# Altium schematic sheet S-Band Antenna.SchDoc: S-Band Antenna
size Letter; Author: Nicholas J. Sorensen; Engineer: Nicholas J. Sorensen; DocumentNumber: 3; SheetNumber: 3; SheetTotal: 4
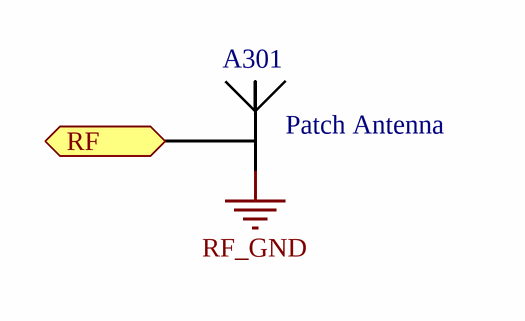
[diagram p0: S-Band Antenna.SchDoc]

## Parts
A301  Patch Antenna  [Patch_Antenna]

## Ports
RF (bidir)

## Nets
RF_GND: A301.2
RF: A301.1 ; port RF

## Notes on the sheet
- (the "License"); you may not use or redistribute this file except in compliance with the License. You
- This file and the information within it are licensed under the terms of the Apache License, Version 2.0
- Copyright
- Unless required by applicable law or agreed to in writing, content distributed under the License is
- distributed on an "AS IS" BASIS, WITHOUT WARRANTIES OR CONDITIONS OF ANY KIND,
- either express or implied. See the License for the specific language governing permissions and
- limitations under the License.
- may obtain a copy of the License at:
- http://www.apache.org/licenses/LICENSE-2.0
- Title
- Size:
- Date:
- Letter
- Number:
- Time:
- Revision:
- Sheet
- of
- University of Alberta
- Deptartment of Electrical
- and Computer Engineering
- Edmonton AB, Canada
- T6G 1H9
- File:

## Library data of the parts
A301 = PXX-ABS-00009: Manufacturer Part Number: Custom; Index: 9; Part Number: PXX-ABS-00009; Supplier 1: Digi-key; Publisher: AlbertaSat; LatestRevisionNote: ...